# EAGLE design PC_ESP8266_Shield (EAGLE 6.4)
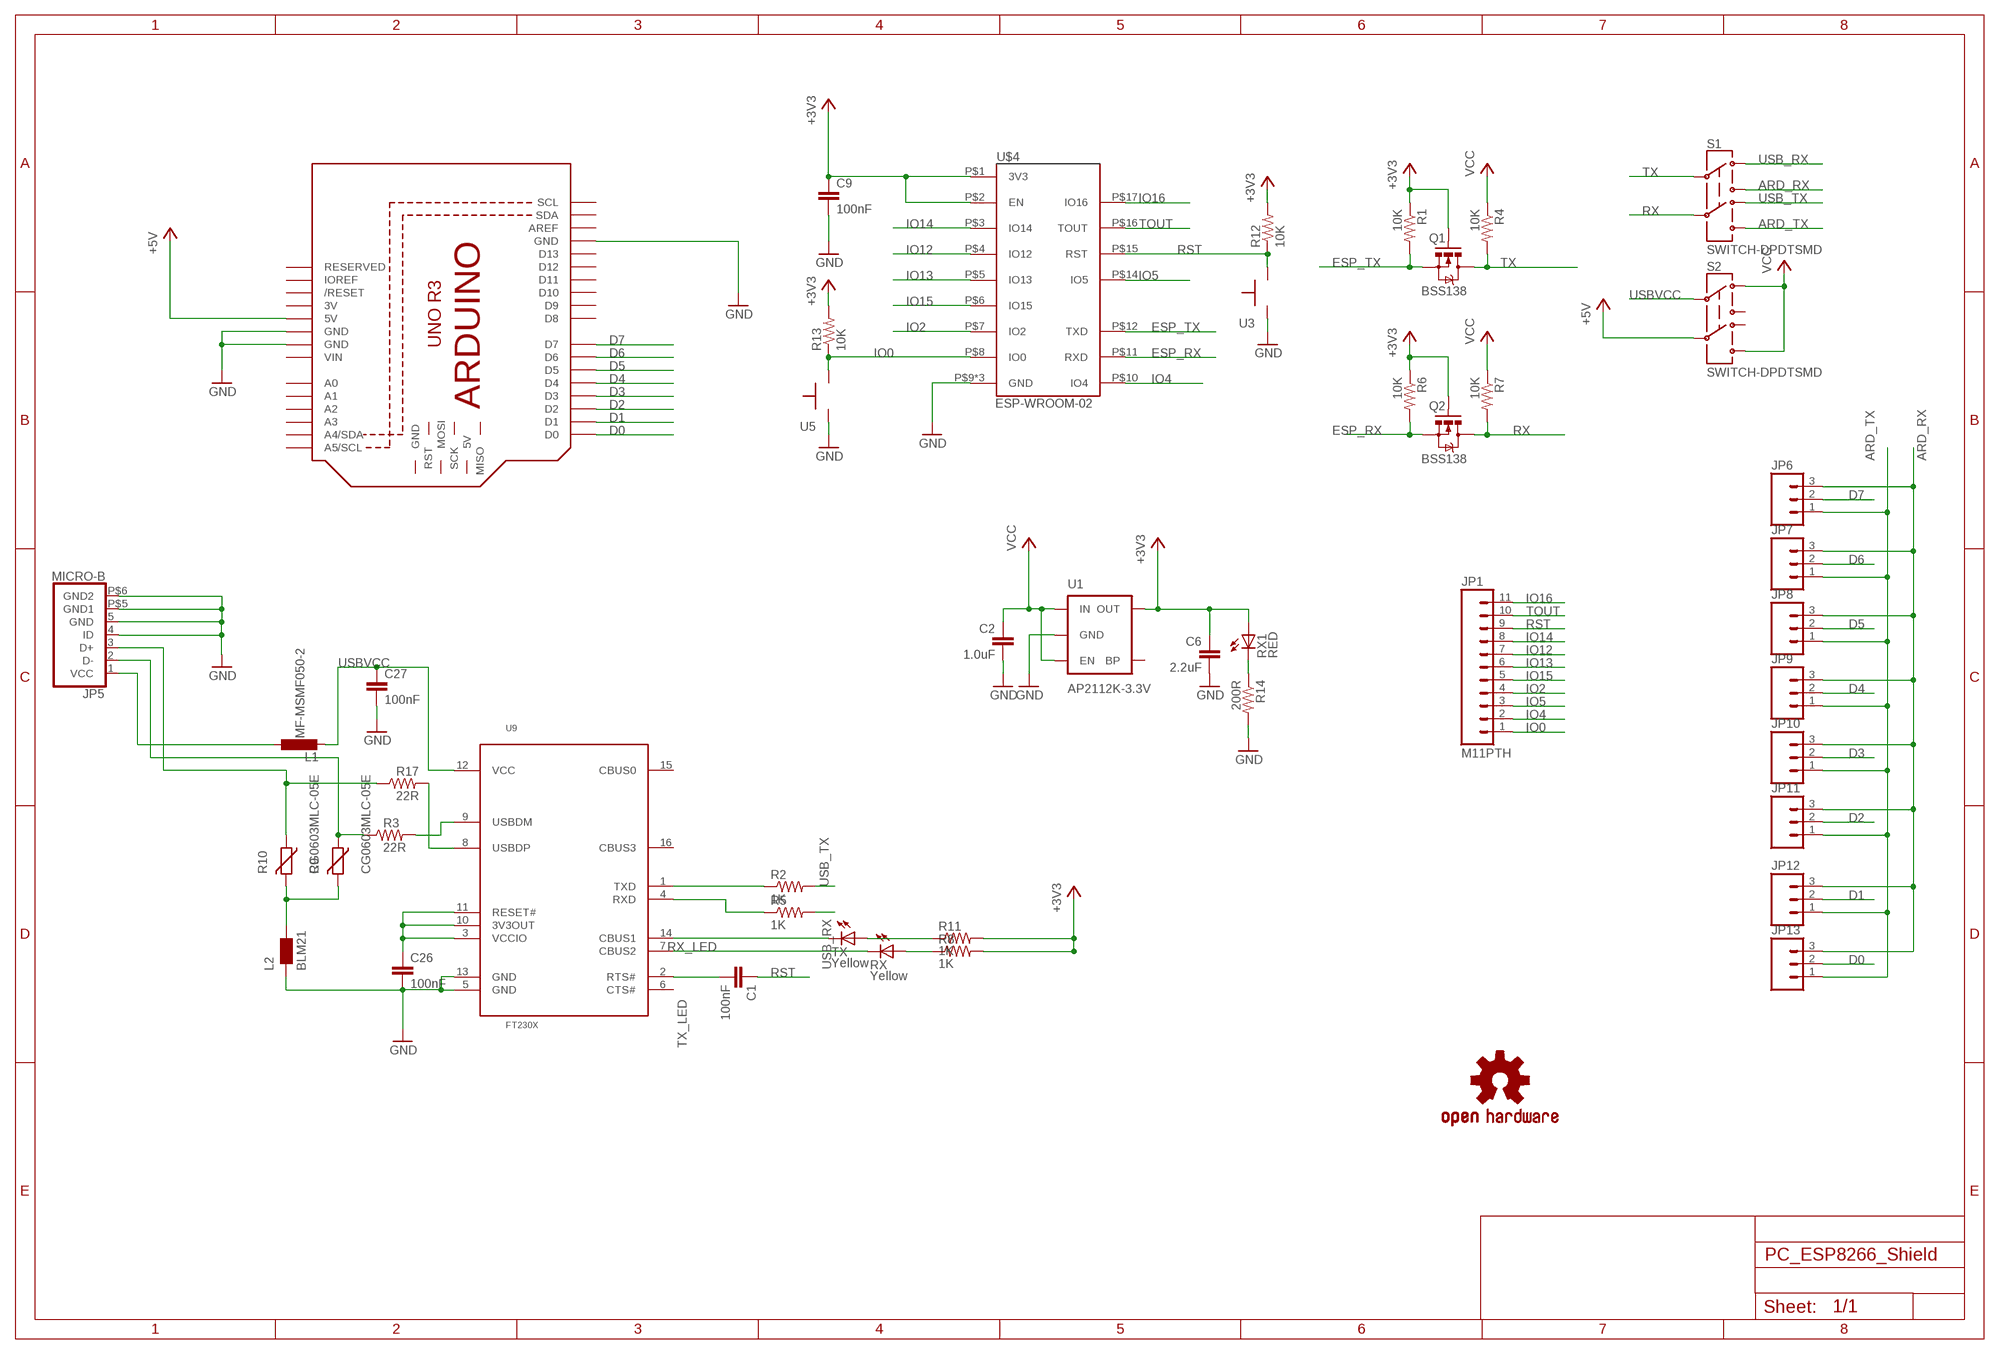
[diagram p0: schematic, sheet 1]

## Parts
C1  100nF  C-EUC0805  [C0805]
C2  1.0uF  1.0UF-25V-+80/-20(0805)  [0805]
C6  2.2uF  C-EUC0805  [C0805]
C9  100nF  C-EUC0805  [C0805]
C26  100nF  C-EUC0805  [C0805]
C27  100nF  C-EUC0805  [C0805]
JP1  M11PTH  [1X11]
JP5  MICRO-B  [MICRO-B]
JP6  M03PTH  [1X03]
JP7  M03PTH  [1X03]
JP8  M03PTH  [1X03]
JP9  M03PTH  [1X03]
JP10  M03PTH  [1X03]
JP11  M03PTH  [1X03]
JP12  M03PTH  [1X03]
JP13  M03PTH  [1X03]
L1  MF-MSMF050-2  L-EUL1812  [L1812]
L2  BLM21  WE-CBF_0805  [0805]
Q1  BSS138  MOSFET-NCHANNELSMD  [SOT23-3]
Q2  BSS138  MOSFET-NCHANNELSMD  [SOT23-3]
R1  10K  R-US_R0805  [R0805]
R2  1K  R-US_R0805  [R0805]
R3  22R  R-US_R0805  [R0805]
R4  10K  R-US_R0805  [R0805]
R5  1K  R-US_R0805  [R0805]
R6  10K  R-US_R0805  [R0805]
R7  10K  R-US_R0805  [R0805]
R8  1K  R-US_R0805  [R0805]
R9  CG0603MLC-05E  VARISTORCN0603  [CT/CN0603]
R10  CG0603MLC-05E  VARISTORCN0603  [CT/CN0603]
R11  1K  R-US_R0805  [R0805]
R12  10K  R-US_R0805  [R0805]
R13  10K  R-US_R0805  [R0805]
R14  200R  R-US_R0805  [R0805]
R17  22R  R-US_R0805  [R0805]
RX  Yellow  LEDCHIPLED_0603  [CHIPLED_0603]
RX1  RED  LEDCHIPLED_0603  [CHIPLED_0603]
S1  SWITCH-DPDTSMD  [AYZ0202]
S2  SWITCH-DPDTSMD  [AYZ0202]
TX  Yellow  LEDCHIPLED_0603  [CHIPLED_0603]
U1  AP2112K-3.3V  V_REG_LDOSMD  [SOT23-5]
U3  B3U-1000P  [B3U-1000P]
U5  B3U-1000P  [B3U-1000P]
U9  FT230X  [SSOP_16]
U$1  ARDUINO  [ARDUINO]
U$3  PROTY-LOGO  [LOGO-PROTY]
U$4  ESP-WROOM-02  [ESP-WROOM-02]
U$5  OSHW-LOGOS  [OSHW-LOGO-S]

## Nets
+3V3: C6.1 C9.1 Q1.1(G) Q2.1(G) R1.1 R6.1 R8.2 R11.2 R12.2 R13.2 RX1.A U1.5(OUT) U$4.P$1(3V3) U$4.P$2(EN)
+5V: S2.5 U$1.5V
ARD_RX: JP6.3 JP7.3 JP8.3 JP9.3 JP10.3 JP11.3 JP12.3 JP13.3 S1.3
ARD_TX: JP6.1 JP7.1 JP8.1 JP9.1 JP10.1 JP11.1 JP12.1 JP13.1 S1.6
D0: JP13.2 U$1.D0
D1: JP12.2 U$1.D1
D2: JP11.2 U$1.D2
D3: JP10.2 U$1.D3
D4: JP9.2 U$1.D4
D5: JP8.2 U$1.D5
D6: JP7.2 U$1.D6
D7: JP6.2 U$1.D7
ESP_RX: Q2.2(S) R6.2 U$4.P$11(RXD)
ESP_TX: Q1.2(S) R1.2 U$4.P$12(TXD)
GND: C2.2 C6.2 C9.2 C26.2 C27.2 JP5.4(ID) JP5.5(GND) JP5.P$5(GND1) JP5.P$6(GND2) L2.1 R14.2 U1.2(GND) U3.P$1 U5.P$1 U9.5(GND) U9.13(GND) U$1.GND U$1.GND@1(GND) U$1.GND@2(GND) U$4.P$9(GND) U$4.P$13(GND) U$4.P$18(GND)
IO0: JP1.1 R13.1 U5.P$2 U$4.P$8(IO0)
IO2: JP1.4 U$4.P$7(IO2)
IO4: JP1.2 U$4.P$10(IO4)
IO5: JP1.3 U$4.P$14(IO5)
IO12: JP1.7 U$4.P$4(IO12)
IO13: JP1.6 U$4.P$5(IO13)
IO14: JP1.8 U$4.P$3(IO14)
IO15: JP1.5 U$4.P$6(IO15)
IO16: JP1.11 U$4.P$17(IO16)
N$1: R2.1 U9.1(TXD)
N$2: C1.2 U9.2(RTS#)
N$3: R5.1 U9.4(RXD)
N$4: R8.1 RX.A
N$5: R11.1 TX.A
N$6: JP5.1(VCC) L1.1
N$7: R14.1 RX1.C
N$9: R3.2 U9.9(USBDM)
N$15: C26.1 U9.3(VCCIO) U9.10(3V3OUT) U9.11(RESET#)
N$16: JP5.2(D-) R3.1 R9.1
N$17: R17.2 U9.8(USBDP)
N$64: L2.2 R9.2 R10.2
N$73: JP5.3(D+) R10.1 R17.1
RST: C1.1 JP1.9 R12.1 U3.P$2 U$4.P$15(RST)
RX: Q2.3(D) R7.2 S1.5
RX_LED: RX.C U9.7(CBUS2)
TOUT: JP1.10 U$4.P$16(TOUT)
TX: Q1.3(D) R4.2 S1.2
TX_LED: TX.C U9.14(CBUS1)
USB_RX: R5.2 S1.1
USB_TX: R2.2 S1.4
USBVCC: C27.1 L1.2 S2.2 U9.12(VCC)
VCC: C2.1 R4.1 R7.1 S2.1 S2.6 U1.1(IN) U1.3(EN)
Unconnected: S2.3 S2.4 U1.4(BP) U9.6(CTS#) U9.15(CBUS0) U9.16(CBUS3) U$1.5V_ICSP(5V) U$1.A0 U$1.A1 U$1.A2 U$1.A3 U$1.A4(A4/SDA) U$1.A5(A5/SCL) U$1.AREF U$1.D8 U$1.D9 U$1.D10 U$1.D11 U$1.D12 U$1.D13 U$1.GND@3(GND) U$1.IOREF U$1.MISO U$1.MOSI U$1.RESERVED U$1.RESET(/RESET) U$1.RESET_ICSP(RST) U$1.SCK U$1.SCL U$1.SDA

## Power pins joined to a net without a drawn wire
3V: U$1.3V
VIN: U$1.VIN

## Library data of the parts
C1 C6 C9 C26 C27 = rcl:C-EU: CAPACITOR, European symbol
C2 = SparkFun-Capacitors:1.0UF-25V-+80/-20(0805): CAP-11625; PROD_ID: CAP-11625
JP1 = SparkFun:M11: Header 11 Standard 11-pin 0.1" header. Use with straight break away headers (SKU : PRT-00116), right angle break away headers (PRT-00553), swiss pins (PRT-00743), machine pins (PRT-00117), and female headers (PRT-00115).
JP5 = circuitects:MICRO-B
JP6-JP13 = SparkFun:M03: Header 3 Standard 3-pin 0.1" header. Use with straight break away headers (SKU : PRT-00116), right angle break away headers (PRT-00553), swiss pins (PRT-00743), machine pins (PRT-00117), and female headers (PRT-00115). Molex polarized connector foot print use with SKU : PRT-08232 with associated crimp pins and housings.
L1 = rcl:L-EU: INDUCTOR, European symbol
L2 = wuerth-elektronik:WE-CBF: SMD EMI Suppression Ferrite Beads - excellent anti-EMI properties - low DCR - impedances till 3000 ohms - rated current up to 6 A
Q1 Q2 = SparkFun:MOSFET-NCHANNEL
R1-R8 R11-R14 R17 = rcl:R-US_: RESISTOR, American symbol
R9 R10 = varistor:VARISTOR: VARISTOR
RX RX1 TX = led:LED: LED OSRAM: - CHIPLED LG R971, LG N971, LY N971, LG Q971, LY Q971, LO R971, LY R971 LH N974, LH R974 LS Q976, LO Q976, LY Q976 LO Q996 - Hyper CHIPLED LW Q18S LB Q993, LB Q99A, LB R99A - SideLED LS A670, LO A670, LY A670, LG A670, LP A670 LB A673, LV A673, LT A673, LW A673 LH A674 LY A675 LS A676, LA A676, LO A676, LY A676, LW A676 LS A679, LY A679, LG A679 - Hyper Micro SIDELED® LS Y876, LA Y876, LO Y876, LY Y876 LT Y87S - SmartLED LW L88C, LW L88S LB L89C, LB L89S, LG L890 LS L89K, LO L89K, LY L89K LS L896, LA L896, LO L896, LY L896 - TOPLED LS T670, LO T670, LY T670, LG T670, LP T670 LSG T670, LSP T670, LSY T670, LOP T670, LYG T670 LG T671, LOG T671, LSG T671 LB T673, LV T673, LT T673, LW T673 LH T674 LS T676, LA T676, LO T676, LY T676, LB T676, LH T676, LSB T676, LW T676 LB T67C, LV T67C, LT T67C, LS T67K, LO T67K, LY T67K, LW E67C LS E67B, LA E67B, LO E67B, LY E67B, LB E67C, LV E67C, LT E67C LW T67C LS T679, LY T679, LG T679 LS T770, LO T770, LY T770, LG T770, LP T770 LB T773, LV T773, LT T773, LW T773 LH T774 LS E675, LA E675, LY E675, LS T675 LS T776, LA T776, LO T776, LY T776, LB T776 LHGB T686 LT T68C, LB T68C - Hyper Mini TOPLED® LB M676 - Mini TOPLED Santana® LG M470 LS M47K, LO M47K, LY M47K Source: http://www.osram.convergy.de LUXEON: - LUMILED® LXK2-PW12-R00, LXK2-PW12-S00, LXK2-PW14-U00, LXK2-PW14-V00 LXK2-PM12-R00, LXK2-PM12-S00, LXK2-PM14-U00 LXK2-PE12-Q00, LXK2-PE12-R00, LXK2-PE12-S00, LXK2-PE14-T00, LXK2-PE14-U00 LXK2-PB12-K00, LXK2-PB12-L00, LXK2-PB12-M00, LXK2-PB14-N00, LXK2-PB14-P00, LXK2-PB14-Q00 LXK2-PR12-L00, LXK2-PR12-M00, LXK2-PR14-Q00, LXK2-PR14-R00 LXK2-PD12-Q00, LXK2-PD12-R00, LXK2-PD12-S00 LXK2-PH12-R00, LXK2-PH12-S00 LXK2-PL12-P00, LXK2-PL12-Q00, LXK2-PL12-R00 Source: www.luxeon.com KINGBRIGHT: KA-3528ASYC Source: www.kingbright.com
S1 S2 = SparkFun:SWITCH-DPDT: DPDT Version of the COM-00597
U1 = SparkFun-PowerIC:V_REG_LDO: Voltage Regulator LDO Standard 150mA LDO voltage regulator in SOT-23 layout. Micrel part MIC5205. BP (by-pass) pin is used to lower output noise with 470pF cap.; PROD_ID: VREG-12457
U3 U5 = circuitects:B3U-1000P
U9 = circuitects:FT230X
U$1 = circuitects:ARDUINO
U$3 = circuitects:PROTY-LOGO
U$4 = esp8266:ESP-WROOM-02
U$5 = SparkFun:OSHW-LOGO: Open Source Hardware Logo This logo indicates the piece of hardware it is found on incorporates a OSHW license and/or adheres to the definition of open source hardware found here: http://freedomdefined.org/OSHW

## Board
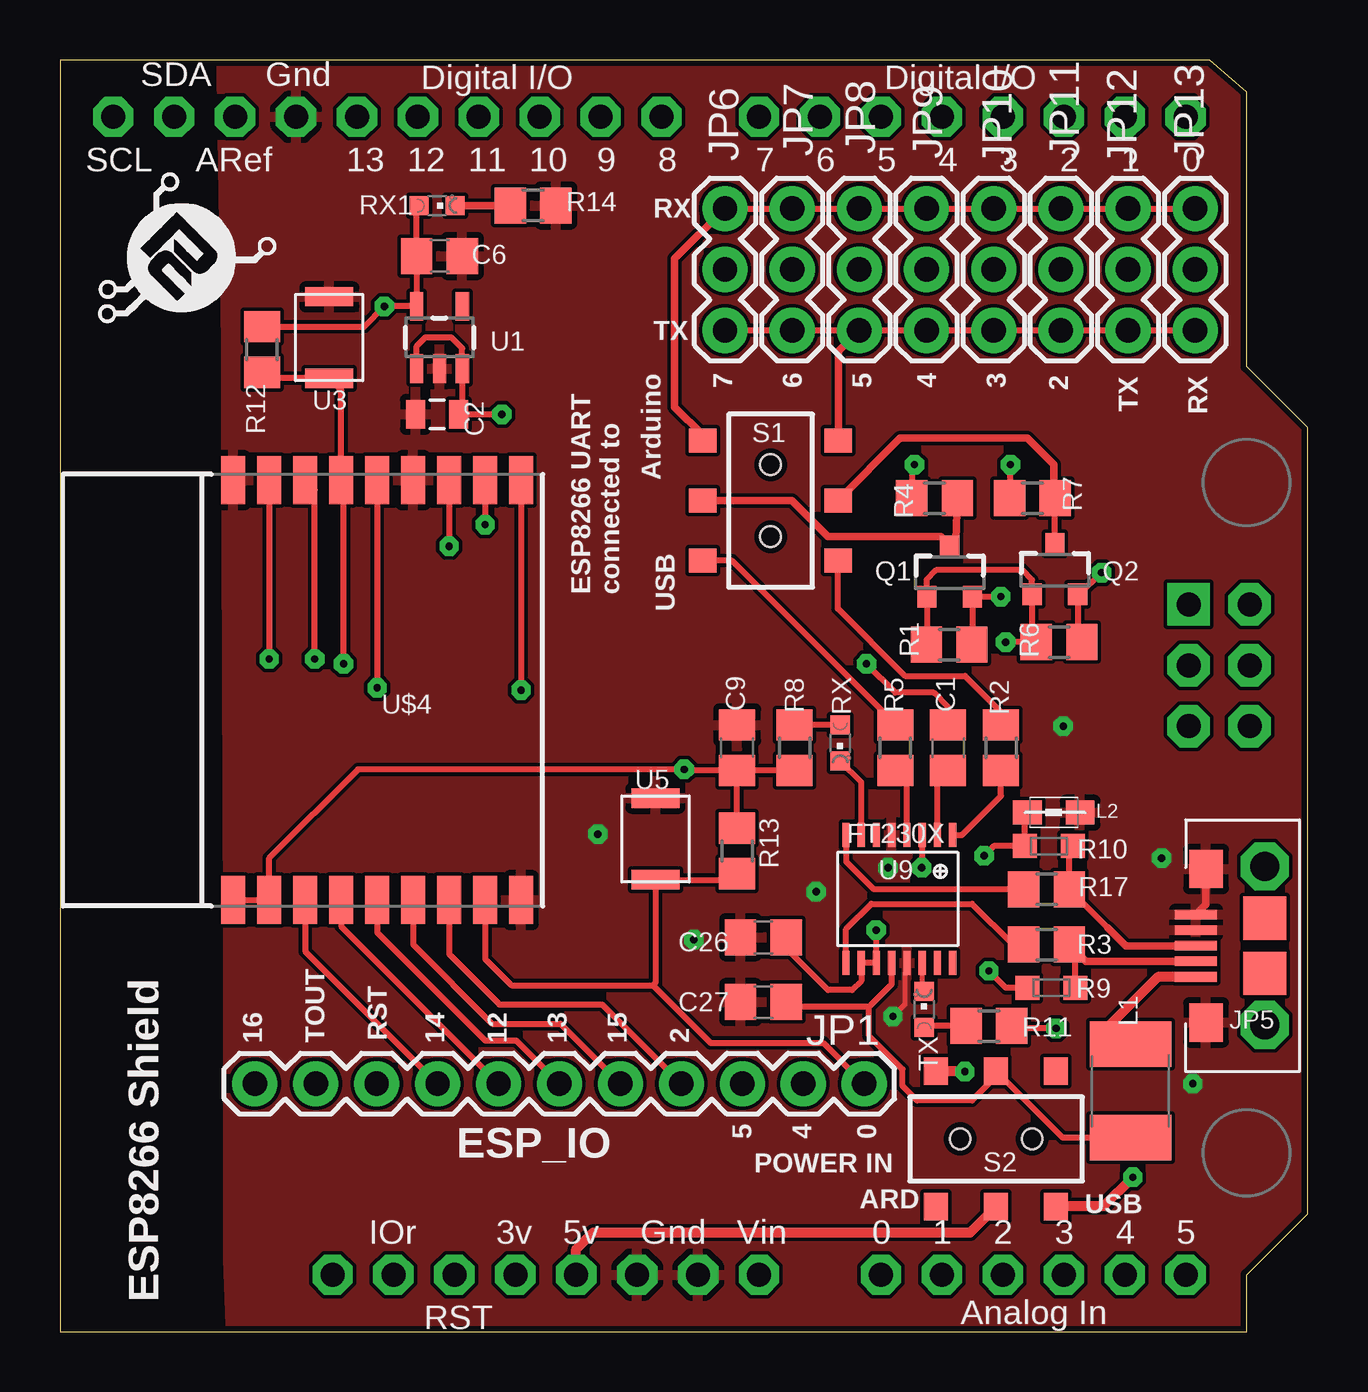
[diagram p1: board, top side]
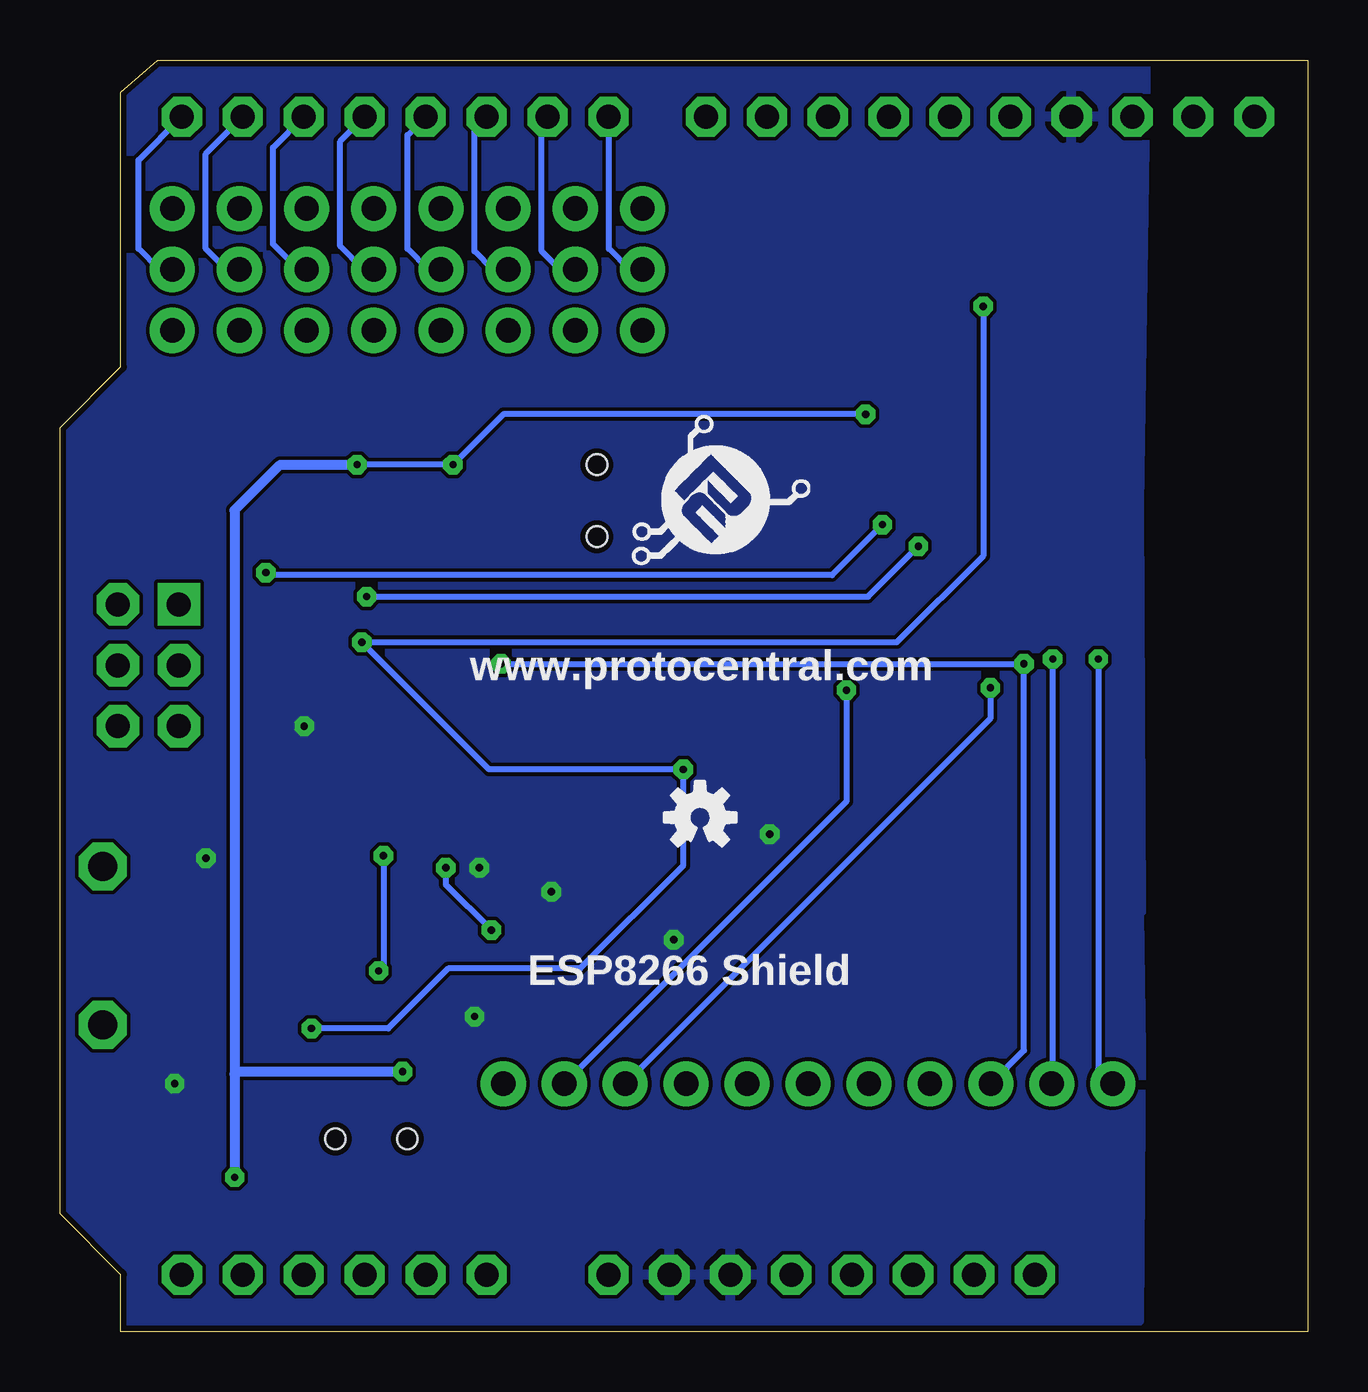
[diagram p2: board, bottom side, seen from below]

Size 52 x 53 mm. Coordinates in mm from the lower left corner, seen from the top.
Copper layers (1*2*15*16): Top 0.035mm / dielectric 1.5mm / Route2 0.035mm / dielectric 0.15mm / Route15 0.035mm / dielectric 0.2mm / Bottom 0.035mm
Design rules "Circuitects-Rules": minimum track width 6mil, minimum drill 0.3mm, track to track 6mil, track to pad 6mil, pad to pad 6mil, via to via 6mil, smd to smd 6mil, copper to edge 10mil, drill to drill 8mil, minimum pad ring 12mil, minimum via ring 10mil, stop-mask expansion 4mil, vias tented up to drill 25mil, thermal gap 10mil

### Footprints (pad centres in the part's own frame; a part is rotated, then mirrored left to right if it is on the bottom)
C0805 = smd 1.3 x 1.5: 1 -0.95,0; 2 0.95,0
0805 = smd 0.8 x 1.2: 1 -0.9,0; 2 0.9,0
1X11 = drill 1.016 pad 1.88: 1 0,0; 2 2.54,0; 3 5.08,0; 4 7.62,0; 5 10.16,0; 6 12.7,0; 7 15.24,0; 8 17.78,0; 9 20.32,0; 10 22.86,0; 11 25.4,0
MICRO-B = smd 0.4 x 1.75: 1 -1.25,2.975; 2 -0.6,2.975; 3 0.05,2.975; 4 0.7,2.975; 5 1.35,2.975 | smd 1.8 x 1.8: P$1 -1.1,0.1; P$2 1.2,0.1 | drill 1.2 pad 2 octagon: P$3 -3.25,0.1; P$4 3.35,0.1 | smd 1.6 x 1.4: P$5 -3.15,2.55; P$6 3.25,2.55
1X03 = drill 1.016 pad 1.88: 1 0,0; 2 2.54,0; 3 5.08,0
L1812 = smd 1.9 x 3.4: 1 -1.95,0; 2 1.95,0
0805' = smd 1.2 x 1: 1 -1.1,0; 2 1.1,0
SOT23-3 = smd 0.8 x 0.9: 1 -0.95,-1; 2 0.95,-1; 3 0,1.1
R0805 = smd 1.3 x 1.5: 1 -0.95,0; 2 0.95,0
CT/CN0603 = smd 1 x 1: 1 -1,0; 2 1,0
CHIPLED_0603 = smd 0.8 x 0.8: A 0,-0.75; C 0,0.75
AYZ0202 = smd 1 x 1.15: 1 -2.5,2.825; 2 0,2.825; 3 2.5,2.825; 4 -2.5,-2.825; 5 0,-2.825; 6 2.5,-2.825 | hole 0.85: 1.5,0; -1.5,0
SOT23-5 = smd 0.55 x 1.2: 1 -0.95,-1.3; 2 0,-1.3; 3 0.95,-1.3; 4 0.95,1.3; 5 -0.95,1.3
B3U-1000P = smd 0.8 x 2: P$1 -1.7,0; P$2 1.7,0
SSOP_16 = smd 0.305 x 0.991: 1 -2.286,-2.667; 2 -1.651,-2.667; 3 -1.016,-2.667; 4 -0.381,-2.667; 5 0.254,-2.667; 6 0.889,-2.667; 7 1.524,-2.667; 8 2.159,-2.667; 9 2.159,2.667; 10 1.524,2.667; 11 0.889,2.667; 12 0.254,2.667; 13 -0.381,2.667; 14 -1.016,2.667; 15 -1.651,2.667; 16 -2.286,2.667
ARDUINO = drill 1 pad 1.676 octagon: 3V 18.96,2.34; 5V 21.5,2.34; A0 34.2,2.34; A1 36.74,2.34; A2 39.28,2.34; A3 41.82,2.34; A4 44.36,2.34; A5 46.9,2.34; AREF 7.276,50.6; D0 46.9,50.6; D1 44.36,50.6; D2 41.82,50.6; D3 39.28,50.6; D4 36.74,50.6; D5 34.2,50.6; D6 31.66,50.6; D7 29.12,50.6; D8 25.056,50.6; D9 22.516,50.6; D10 19.976,50.6; D11 17.436,50.6; D12 14.896,50.6; D13 12.356,50.6; GND 9.816,50.6; GND@1 26.58,2.34; GND@2 24.04,2.34; IOREF 13.88,2.34; RESERVED 11.34,2.34; RESET 16.42,2.34; SCL 2.196,50.6; SDA 4.736,50.6; VIN 29.12,2.34 | drill 1 pad 1.778 octagon: 5V_ICSP 49.567,30.28; GND@3 49.567,25.2; MOSI 49.567,27.74; RESET_ICSP 47.027,25.2; SCK 47.027,27.74 | drill 1 pad 1.778 square: MISO 47.027,30.28
ESP-WROOM-02 = smd 2 x 0.99: P$1 -8.75,2.9; P$2 -8.75,1.4; P$3 -8.75,-0.1; P$4 -8.75,-1.6; P$5 -8.75,-3.1; P$6 -8.75,-4.6; P$7 -8.75,-6.1; P$8 -8.75,-7.6; P$9 -8.75,-9.1; P$10 8.75,-9.1; P$11 8.75,-7.6; P$12 8.75,-6.1; P$13 8.75,-4.6; P$14 8.75,-3.1; P$15 8.75,-1.6; P$16 8.75,-0.1; P$17 8.75,1.4; P$18 8.75,2.9

### Placement (x,y rotation side)
C1  37.02,24.33 270 top
C2  15.72,38.23 180 top
C6  15.82,44.83 0 top
C9  28.22,24.33 90 top
C26  29.32,16.43 180 top
C27  29.32,13.73 180 top
JP1  33.52,10.33 180 top
JP5  50.32,16.03 90 top
JP6  27.72,41.73 90 top
JP7  30.52,41.73 90 top
JP8  33.32,41.73 90 top
JP9  36.12,41.73 90 top
JP10  38.92,41.73 90 top
JP11  41.72,41.73 90 top
JP12  44.52,41.73 90 top
JP13  47.32,41.73 90 top
L1  44.62,10.03 270 top
L2  BLM21  [0805']  41.42,21.63 180 top
Q1  37.08,31.63 0 top
Q2  41.47,31.73 0 top
R1  37.06,28.63 0 top
R2  39.22,24.33 90 top
R3  41.12,16.13 180 top
R4  36.45,34.73 0 top
R5  34.82,24.33 90 top
R6  41.64,28.73 0 top
R7  40.53,34.73 0 top
R8  30.62,24.33 270 top
R9  41.32,14.33 180 top
R10  41.22,20.23 180 top
R11  38.72,12.73 0 top
R12  8.42,40.93 90 top
R13  28.22,20.03 90 top
R14  19.72,46.93 0 top
R17  41.12,18.43 180 top
RX  32.52,24.53 180 top
RX1  15.72,46.93 270 top
S1  29.62,34.63 90 top
S2  39.02,8.03 0 top
TX  36.02,13.43 0 top
U1  15.82,41.43 0 top
U3  11.22,41.43 270 top
U5  24.82,20.53 270 top
U9  34.92,18.03 180 top
U$1  0.02,0.03 0 top
U$2  PROTY-LOGO  [LOGO-PROTY]  1.52,41.93 0 top
U$3  28.22,31.83 0 bottom
U$4  10.12,26.73 90 top
U$5  25.32,21.43 0 bottom

### Tracks (layer width: path | path; a pad name or v marks a point on that pad's centre or on a via)
+3V3  (via drill 0.3)
  Top 0.254: R1.1 36.13,28.66 Q1.1 36.12,31.33 36.52,31.73 40.12,31.73 40.52,31.33 Q2.1 40.52,28.95 R6.1 | U$4.P$1 U$4.P$2 8.72,19.73 12.42,23.43 v26.02,23.43 26.07,23.38 C9.1 | 40.72,28.71 R6.1 | R6.1 v39.42,28.73 | R8.2 C9.1 | R13.2 C9.1 | v13.52,42.73 U1.5 C6.1 14.87,46.83 RX1.A | v13.52,42.73 | R12.2 12.67,41.88 v13.52,42.73 | v41.52,12.63 39.77,12.63 R11.2
  Top 0.305: 14.72,47.18 RX1.A
  Bottom 0.254: v13.52,42.73 13.52,32.33 17.12,28.73 v39.42,28.73 34.12,23.43 v26.02,23.43 26.02,19.43 30.32,15.13 35.82,15.13 38.32,12.63 v41.52,12.63
+5V
  Top 0.406: U$1.5V 21.52,3.43 22.22,4.13 37.95,4.13 S2.5
ARD_RX
  Top 0.254: JP6.3 JP7.3 JP8.3 JP9.3 JP10.3 JP11.3 JP12.3 JP13.3
  Top 0.305: S1.3 26.79,37.36 25.62,38.53 25.62,44.71 JP6.3
ARD_TX
  Top 0.254: JP6.1 JP7.1 JP8.1 JP9.1 JP10.1 JP11.1 JP12.1 JP13.1
  Top 0.305: S1.6 32.45,40.86 JP8.1
D0
  Bottom 0.254: JP13.2 47.86,44.27 48.72,45.13 48.72,48.83 U$1.D0
D1
  Bottom 0.254: JP12.2 45.06,44.27 45.92,45.13 45.92,49.09 U$1.D1
D2
  Bottom 0.254: JP11.2 42.06,44.27 43.12,45.33 43.12,49.35 U$1.D2
D3
  Bottom 0.254: JP10.2 39.36,44.27 40.32,45.23 40.32,49.61 U$1.D3
D4
  Bottom 0.254: JP9.2 36.66,44.27 37.52,45.13 37.52,49.87 U$1.D4
D5
  Bottom 0.254: JP8.2 33.96,44.27 34.72,45.03 34.72,50.13 U$1.D5
D6
  Bottom 0.254: JP7.2 31.16,44.27 31.92,45.03 31.92,50.39 U$1.D6
D7
  Bottom 0.254: JP6.2 28.26,44.27 29.12,45.13 29.12,50.61 U$1.D7
ESP_RX  (via drill 0.3)
  Top 0.254: R6.2 42.42,28.85 Q2.2 42.52,30.73 v43.42,31.63 | U$4.P$11 v17.72,33.63
  Bottom 0.254: v17.72,33.63 19.82,31.53 43.32,31.53 v43.42,31.63
ESP_TX  (via drill 0.3)
  Top 0.254: R1.2 38.03,28.7 Q1.2 v39.22,30.63 | U$4.P$12 v16.22,32.73
  Bottom 0.254: v39.22,30.63 18.32,30.63 v16.22,32.73
GND  (via drill 0.3)
  Top 0.2: U9.13 35.3,15.01 35.22,14.93 35.22,13.63 v34.72,13.13
  Top 0.305: JP5.P$6 47.77,17.8 JP5.5
  other vias: 41.82,25.23 34.52,19.33 31.52,18.33 26.42,16.33 47.22,10.33 22.42,20.73 45.92,19.73
  pour Top: 6.72,53.53 52.12,53.83 52.12,0.13 7.12,0.23 7.02,3.03 7.02,17.03 6.92,37.93 6.92,41.23
  pour Bottom: 6.72,53.53 52.12,53.53 52.12,0.03 7.02,0.43 6.92,11.73 7.02,17.43 7.02,17.53 6.92,17.53 7.02,34.43
IO0
  Top 0.254: U$4.P$8 17.72,15.53 18.82,14.43 24.72,14.43 | JP1.1 31.82,12.03 27.12,12.03 24.72,14.43 | R13.1 27.97,18.83 U5.P$2 24.82,14.53 24.72,14.43
IO2
  Top 0.254: U$4.P$7 16.22,15.73 18.32,13.63 22.6,13.63 JP1.4
IO4  (via drill 0.3)
  Top 0.254: U$4.P$10 v19.22,26.73
  Bottom 0.254: v19.22,26.73 19.22,22.09 JP1.2
IO5  (via drill 0.3)
  Top 0.254: U$4.P$14 v13.22,26.83
  Bottom 0.254: v13.22,26.83 13.22,25.55 JP1.3
IO12
  Top 0.254: U$4.P$4 11.72,16.89 JP1.7
IO13
  Top 0.254: U$4.P$5 13.22,16.63 17.72,12.13 19.02,12.13 JP1.6
IO14
  Top 0.254: U$4.P$3 10.22,15.85 JP1.8
IO15
  Top 0.254: U$4.P$6 14.72,16.13 18.02,12.83 20.86,12.83 JP1.5
IO16  (via drill 0.3)
  Top 0.254: U$4.P$17 v8.72,28.03
  Bottom 0.254: v8.72,28.03 8.72,10.93 JP1.11
N$1
  Top 0.254: U9.1 37.59,20.7 39.22,22.33 R2.1
N$2
  Top 0.254: U9.2 36.57,22.93 C1.2
N$3
  Top 0.254: U9.4 35.3,22.9 R5.1
N$4
  Top 0.254: RX.A R8.1
N$5
  Top 0.254: R11.1 36.07,12.73 TX.A
N$6
  Top 0.305: 43.72,11.48 L1.1
  Top 0.406: JP5.1 45.77,14.78 43.72,12.73 43.72,11.48
N$7
  Top 0.305: RX1.C R14.1
N$9
  Top 0.254: R3.2 39.72,16.13 38.02,17.83 33.82,17.83 32.76,16.77 U9.9
N$15  (via drill 0.3)
  Top 0.254: U9.3 35.94,19.35 v35.92,19.33 | v34.02,16.73 34.03,16.72 U9.11 U9.10 33.4,14.61 33.02,14.23 32.02,14.23 30.27,15.98 C26.1
  Bottom 0.254: v35.92,19.33 35.92,18.63 v34.02,16.73
N$16
  Top 0.254: 42.27,16.33 R3.1 42.32,15.88 R9.1
  Top 0.305: 42.12,16.18 R3.1 42.77,15.43 JP5.2
N$17
  Top 0.254: R17.2 33.92,18.43 32.76,19.59 U9.8
N$64  (via drill 0.3)
  Top 0.254: v38.52,19.83 38.92,20.23 R10.2 40.22,21.53 L2.2 | R9.2 39.42,14.33 v38.72,15.03
  Bottom 0.254: v38.52,19.83 38.52,15.23 v38.72,15.03
N$73
  Top 0.254: 43.67,16.83 R17.1 42.07,20.08 R10.1
  Top 0.305: JP5.3 44.42,16.08 43.67,16.83
RST  (via drill 0.3)
  Top 0.254: v11.82,27.83 11.82,35.38 U$4.P$15 11.72,39.23 U3.P$2 8.67,39.73 R12.1 | C1.1 37.02,26.03 36.42,26.63 34.82,26.63 v33.62,27.83
  Bottom 0.254: JP1.9 11.82,11.71 v11.82,27.83 v33.62,27.83
RX
  Top 0.254: Q2.3 41.47,34.69 R7.2
  Top 0.305: S1.5 32.45,34.66 35.02,37.23 40.32,37.23 41.42,36.13 41.42,34.74 R7.2
RX_LED
  Top 0.254: U9.7 33.4,22.9 RX.C
TOUT  (via drill 0.3)
  Top 0.254: v10.62,28.03 10.62,35.08 U$4.P$16
  Bottom 0.254: v10.62,28.03 10.62,10.37 JP1.10
TX
  Top 0.305: R4.2 37.35,33 Q1.3 37.08,32.77 36.72,33.13 32.02,33.13 30.52,34.63 S1.2
TX_LED
  Top 0.2: U9.14 35.94,14.26 TX.C
USB_RX
  Top 0.254: R5.2 34.82,25.33 28.02,32.13 S1.1
USB_TX
  Top 0.254: R2.2 39.22,25.83 37.72,27.33 35.22,27.33 32.42,30.13 32.42,32.11 S1.4
USBVCC
  Top 0.254: U9.12 34.67,14.48 33.72,13.53 | 33.72,13.53 30.47,13.53 C27.1 | 33.72,13.53 33.72,12.33 35.12,10.93 35.12,10.23 35.72,9.63 38.02,9.63 39.02,10.63 S2.2 41.8,8.08 L1.2
VCC  (via drill 0.3)
  Top 0.254: R7.1 v39.63,36.12 v39.62,36.13 | R4.1 35.55,36.06 v35.62,36.13 | U1.1 14.87,41.08 15.22,41.43 16.32,41.43 16.77,40.98 U1.3 16.77,38.38 C2.1 v18.42,38.23
  Top 0.406: S2.1 37.7,10.85 v37.72,10.83 | S2.6 41.55,5.23 43.52,5.23 v44.72,6.43
  Bottom 0.254: v39.62,36.13 v35.62,36.13 33.52,38.23 v18.42,38.23
  Bottom 0.406: v39.62,36.13 42.82,36.13 44.72,34.23 44.72,10.73 | 44.72,10.73 v44.72,6.43 | v37.72,10.83 44.62,10.83 44.72,10.73

### Text on the board
tPlace: RX | TX | Arduino | 7 | 6 | 5 | 4 | 3 | 2 | U3 | TX | RX | ESP8266 UART / connected to | USB | U5 | 16 | TOUT | RST | 14 | 12 | 13 | 15 | 2 | 5 | 4 | 0 | ESP_IO | POWER IN | ARD | USB | ESP8266 Shield
bPlace: www.protocentral.com | ESP8266 Shield